# Altium schematic sheet Power_Board_5V.SchDoc
size A4; Date: 11-13-2024; ApprovedBy: Yi Ping; CheckedBy: Yi Ping; Author: Radioman; CompanyName: WXIT; DrawnBy: Radioman; Revision: V1; SheetNumber: 1; SheetTotal: 1; SPICEModelCacheNGACZHQT: <root> / <DocumentId>NGACZHQT</DocumentId> / <CacheFrame Number="0"> / <Model Name="diode" Kind="MDL"> / <Text>*Default Diode / *Diode Pinout: A,K / .MODEL DIODE D()</Text> / </Model> / </CacheFrame> / </root>; Time: 10:17
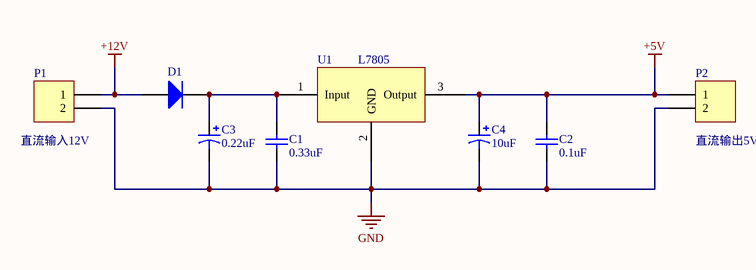
[diagram p0: Power_Board_5V.SchDoc]

## Parts
C1  value 0.33uF  [RAD-0.3]  (hidden comment: Cap)
C2  value 0.1uF  [RAD-0.3]  (hidden comment: Cap)
C3  value 0.22uF  [RB7.6-15]  (hidden comment: Cap Pol1)
C4  value 10uF  [RB7.6-15]  (hidden comment: Cap Pol1)
D1  Diode  [SMC]  (value not drawn)
P1  Header 2  [HDR1X2]  (value not drawn)
P2  Header 2  [HDR1X2]  (value not drawn)
U1  L7805

## Nets
+5V: C2.2 C4.1 P2.1 U1.3(Output)
+12V: D1.1(A) P1.1
GND: C1.1 C2.1 C3.2 C4.2 P1.2 P2.2 U1.2(GND)
NetC1_2: C1.2 C3.1 D1.2(K) U1.1(Input)

## Notes on the sheet
- (near P1) 直流输入12V
- (near P2) 直流输出5V

## Library data of the parts
C1 C2 = Cap: Capacitor; Published: 8-Jun-2000; LatestRevisionDate: 17-Jul-2002; LatestRevisionNote: Re-released for DXP Platform.; PackageReference: RAD-0.3; Publisher: Altium Limited; PackageDescription: Radial Cap, Thru-Hole; 2 Leads; 0.3 in Pin Spacing
C3 C4 = Cap Pol1: Polarized Capacitor (Radial); Published: 8-Jun-2000; LatestRevisionDate: 17-Jul-2002; LatestRevisionNote: Re-released for DXP Platform.; PackageReference: RB7.6-15; Publisher: Altium Limited; PackageDescription: Polarized Capacitor (Radial); 2 Leads
D1 = Diode: Default Diode; Published: 8-Jun-2000; LatestRevisionDate: 17-Jul-2002; LatestRevisionNote: Re-released for DXP Platform.; PackageVersion: Sep-1996; PackageReference: SMC; Publisher: Altium Limited; PackageDescription: DO-214-AB/SMC; 2 C-Bend Leads; Body 7.9 x 5.9 mm, inc. leads (LxW); Code_JEDEC: DO-214-AB
P1 P2 = Header 2: Header, 2-Pin; LatestRevisionDate: 17-Jul-2002; LatestRevisionNote: Re-released for DXP Platform.; Publisher: Altium Limited